# EAGLE design batt_mon_v1 (EAGLE 7.7.0)
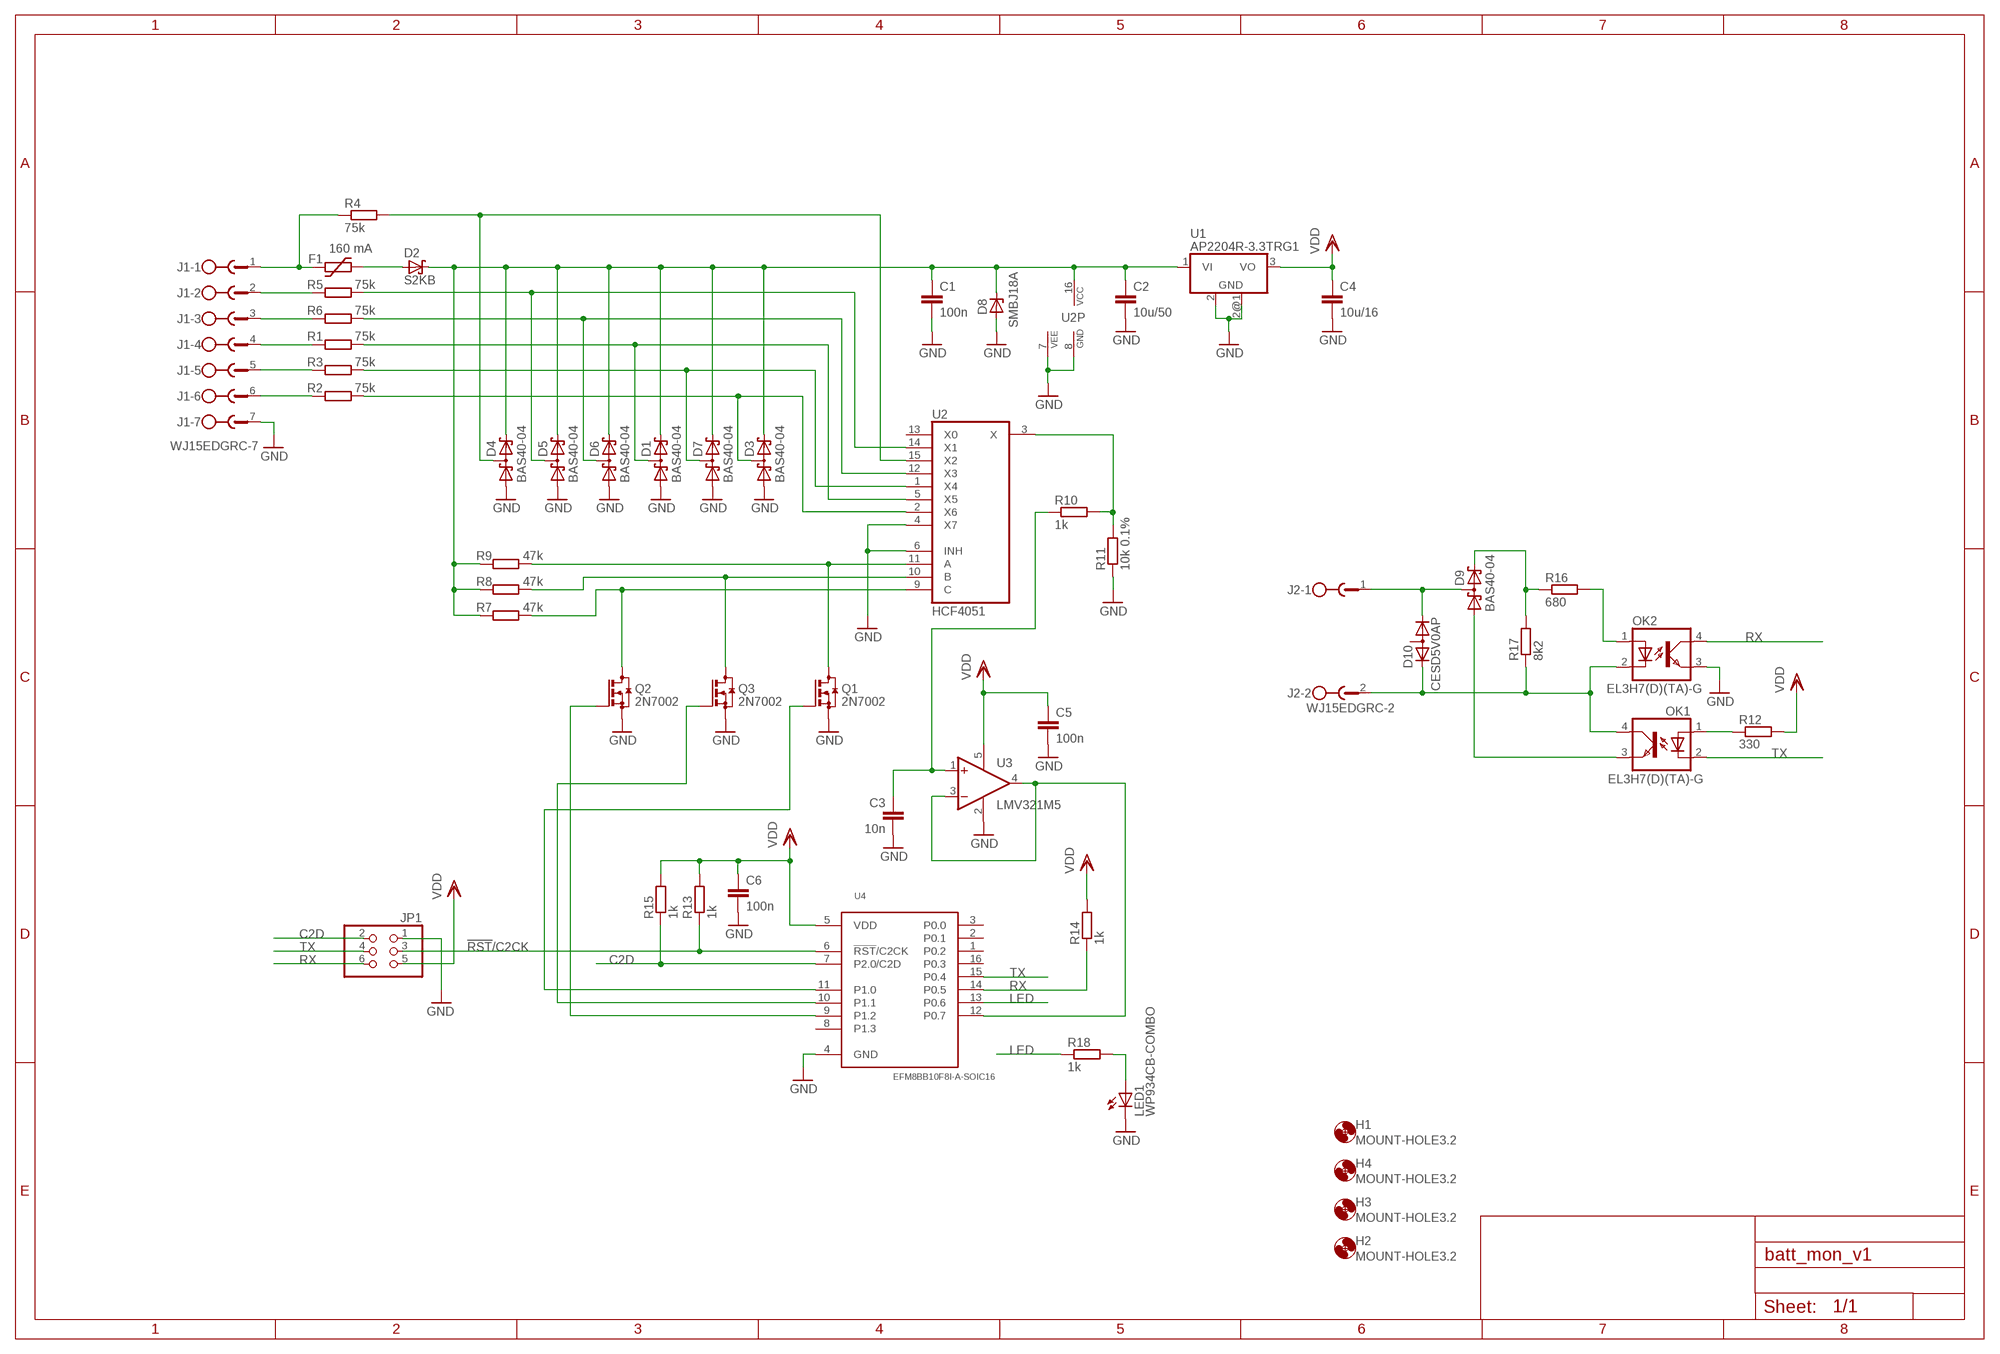
[diagram p0: schematic, sheet 1]

## Parts
C1  100n  C-EUC0805  [C0805]
C2  10u/50  C-EUC1206  [C1206]
C3  10n  C-EUC0805  [C0805]
C4  10u/16  C-EUC1206  [C1206]
C5  100n  C-EUC0805  [C0805]
C6  100n  C-EUC0805  [C0805]
D1  BAS40-04  [SOT23]
D2  S2KB  SCHOTTKY-DIODESMD  [SMB]
D3  BAS40-04  [SOT23]
D4  BAS40-04  [SOT23]
D5  BAS40-04  [SOT23]
D6  BAS40-04  [SOT23]
D7  BAS40-04  [SOT23]
D8  SMBJ18A  ZENER-DIODESMB  [SMB]
D9  BAS40-04  [SOT23]
D10  CESD5V0AP  DIODE-2CA|ACSOT23  [SOT23]
F1  160 mA  1206L  [1206L]
H1  MOUNT-HOLE3.2  [3,2]
H2  MOUNT-HOLE3.2  [3,2]
H3  MOUNT-HOLE3.2  [3,2]
H4  MOUNT-HOLE3.2  [3,2]
J1  WJ15EDGRC-7  [WJ15EDGRC-3.81-7]
J2  WJ15EDGRC-2  [WJ15EDGRC-3.81-2]
JP1  PINHD-2X3  [2X03]
LED1  WP934CB-COMBO  [WP934CB-COMBO]
OK1  EL3H7(D)(TA)-G  EL3H7  [MINI-FLAT-4]
OK2  EL3H7(D)(TA)-G  EL3H7  [MINI-FLAT-4]
Q1  2N7002  BSS123  [SOT23]
Q2  2N7002  BSS123  [SOT23]
Q3  2N7002  BSS123  [SOT23]
R1  75k  R-EU_R1206  [R1206]
R2  75k  R-EU_R1206  [R1206]
R3  75k  R-EU_R1206  [R1206]
R4  75k  R-EU_R1206  [R1206]
R5  75k  R-EU_R1206  [R1206]
R6  75k  R-EU_R1206  [R1206]
R7  47k  R-EU_R0805  [R0805]
R8  47k  R-EU_R0805  [R0805]
R9  47k  R-EU_R0805  [R0805]
R10  1k  R-EU_R0805  [R0805]
R11  10k 0.1%  R-EU_R0805  [R0805]
R12  330  R-EU_R0805  [R0805]
R13  1k  R-EU_R0805  [R0805]
R14  1k  R-EU_R0805  [R0805]
R15  1k  R-EU_R0805  [R0805]
R16  680  R-EU_R0805  [R0805]
R17  8k2  R-EU_R0805  [R0805]
R18  1k  R-EU_R0805  [R0805]
U1  AP2204R-3.3TRG1  MCP175433MB  [SOT89]
U2  HCF4051  4051D  [SO16]
U3  LMV321M5  [SOT23-5]
U4  EFM8BB10F8I-A-SOIC16  EFM8BB1  [SO16]

## Nets
!RST!/C2CK: JP1.3 R13.1 U4.6(!RST!/C2CK)
C2D: JP1.2 R15.1 U4.7(P2.0/C2D)
GND: C1.2 C2.2 C3.2 C4.2 C5.2 C6.2 D1.1(A1) D3.1(A1) D4.1(A1) D5.1(A1) D6.1(A1) D7.1(A1) D8.A J1.7 JP1.1 LED1.K1(C) LED1.K(C) OK2.3(EMIT) Q1.2(S) Q2.2(S) Q3.2(S) R11.1 U1.2(GND) U1.2@1(GND) U2.4(X7) U2.6(INH) U2.7(VEE) U2.8(GND) U3.2(V-) U4.4(GND)
LED: R18.1 U4.13(P0.6)
N$1: R10.2 R11.2 U2.3(X)
N$2: Q1.3(D) R9.2 U2.11(A)
N$3: Q3.3(D) R8.2 U2.10(B)
N$4: Q2.3(D) R7.2 U2.9(C)
N$5: D1.3(C1A2) R1.2 U2.5(X5)
N$6: F1.P$1 J1.1 R4.1
N$7: D4.3(C1A2) R4.2 U2.15(X2)
N$8: J1.2 R5.1
N$9: D5.3(C1A2) R5.2 U2.14(X1)
N$10: D6.3(C1A2) R6.2 U2.12(X3)
N$11: J1.3 R6.1
N$12: C3.1 R10.1 U3.1(+IN)
N$13: D2.A F1.P$2
N$14: J1.4 R1.1
N$15: Q2.1(G) U4.9(P1.2)
N$16: Q3.1(G) U4.10(P1.1)
N$17: Q1.1(G) U4.11(P1.0)
N$18: C1.1 C2.1 D1.2(C2) D2.C D3.2(C2) D4.2(C2) D5.2(C2) D6.2(C2) D7.2(C2) D8.C R7.1 R8.1 R9.1 U1.1(VI) U2.16(VCC)
N$19: J1.6 R2.1
N$20: J1.5 R3.1
N$21: OK2.1(A) R16.2
N$22: D9.1(A1) OK1.3(EMIT)
N$23: OK1.1(A) R12.1
N$24: D9.3(C1A2) D10.1(K1) J2.1
N$25: U3.3(-IN) U3.4(OUT) U4.12(P0.7)
N$26: D3.3(C1A2) R2.2 U2.2(X6)
N$27: D9.2(C2) R16.1 R17.2
N$28: LED1.A LED1.A1(A) R18.2
N$34: D7.3(C1A2) R3.2 U2.1(X4)
R-: D10.2(K2) J2.2 OK1.4(COL) OK2.2(C) R17.1
RX: JP1.6 OK2.4(COL) R14.1 U4.14(P0.5)
TX: JP1.4 OK1.2(C) U4.15(P0.4)
VDD: C4.1 C5.1 C6.1 JP1.5 R12.2 R13.2 R14.2 R15.2 U1.3(VO) U3.5(V+) U4.5(VDD)
Unconnected: D10.3(A) U2.13(X0) U4.1(P0.2) U4.2(P0.1) U4.3(P0.0) U4.8(P1.3) U4.16(P0.3)

## Library data of the parts
C1-C6 = rcl:C-EU: CAPACITOR, European symbol
D1 D3-D7 D9 = diode:BAS40-04: Silicon Schottky Diodes General-purpose diode for high-speed switching
D2 = diode:SCHOTTKY-DIODE: Schottky Diode
D8 = diode:ZENER-DIODE: Z-Diode
D10 = diode:DIODE-2CA|AC: Dual DIODE Cathode-Anode|Anode-Cathode
F1 = ptc-littlefuse (5):1206L
H1-H4 = holes:MOUNT-HOLE: MOUNTING HOLE with drill center marker
J1 = WJ15EDGRC:WJ15EDGRC-7
J2 = WJ15EDGRC:WJ15EDGRC-2
JP1 = pinhead:PINHD-2X3: PIN HEADER
LED1 = WP934CB:WP934CB: Low Current (2mA) LED 3 mm Tinted Diffused Package color RED Source: Data sheet <http://www.farnell.com/datasheets/391100.pdf>
OK1 OK2 = opto:EL3H7
Q1-Q3 = transistor-small-signal:BSS123: N-CHANNEL MOS FET
R1-R18 = rcl:R-EU_: RESISTOR, European symbol
U1 = MCP1754:MCP1754*: 250 mA, 16V, Low Quiescent Current LDO Regulator Source: http://ww1.microchip.com/downloads/en/DeviceDoc/22049b.pdf; MOUSER: 579-MCP1755ST1802EDB
U2 = 40xx:4051: 8-channel ANALOG MULTIPLEXER
U3 = linear:LMV321?*: General Purpose, Low Voltage, Rail-to-Rail Output Operational Amplifiers Source: http://www.national.com/mpf/LM/LMV321.html http://www.national.com/dt/lmv_qual.pdf
U4 = efm8:EFM8BB1

## Board
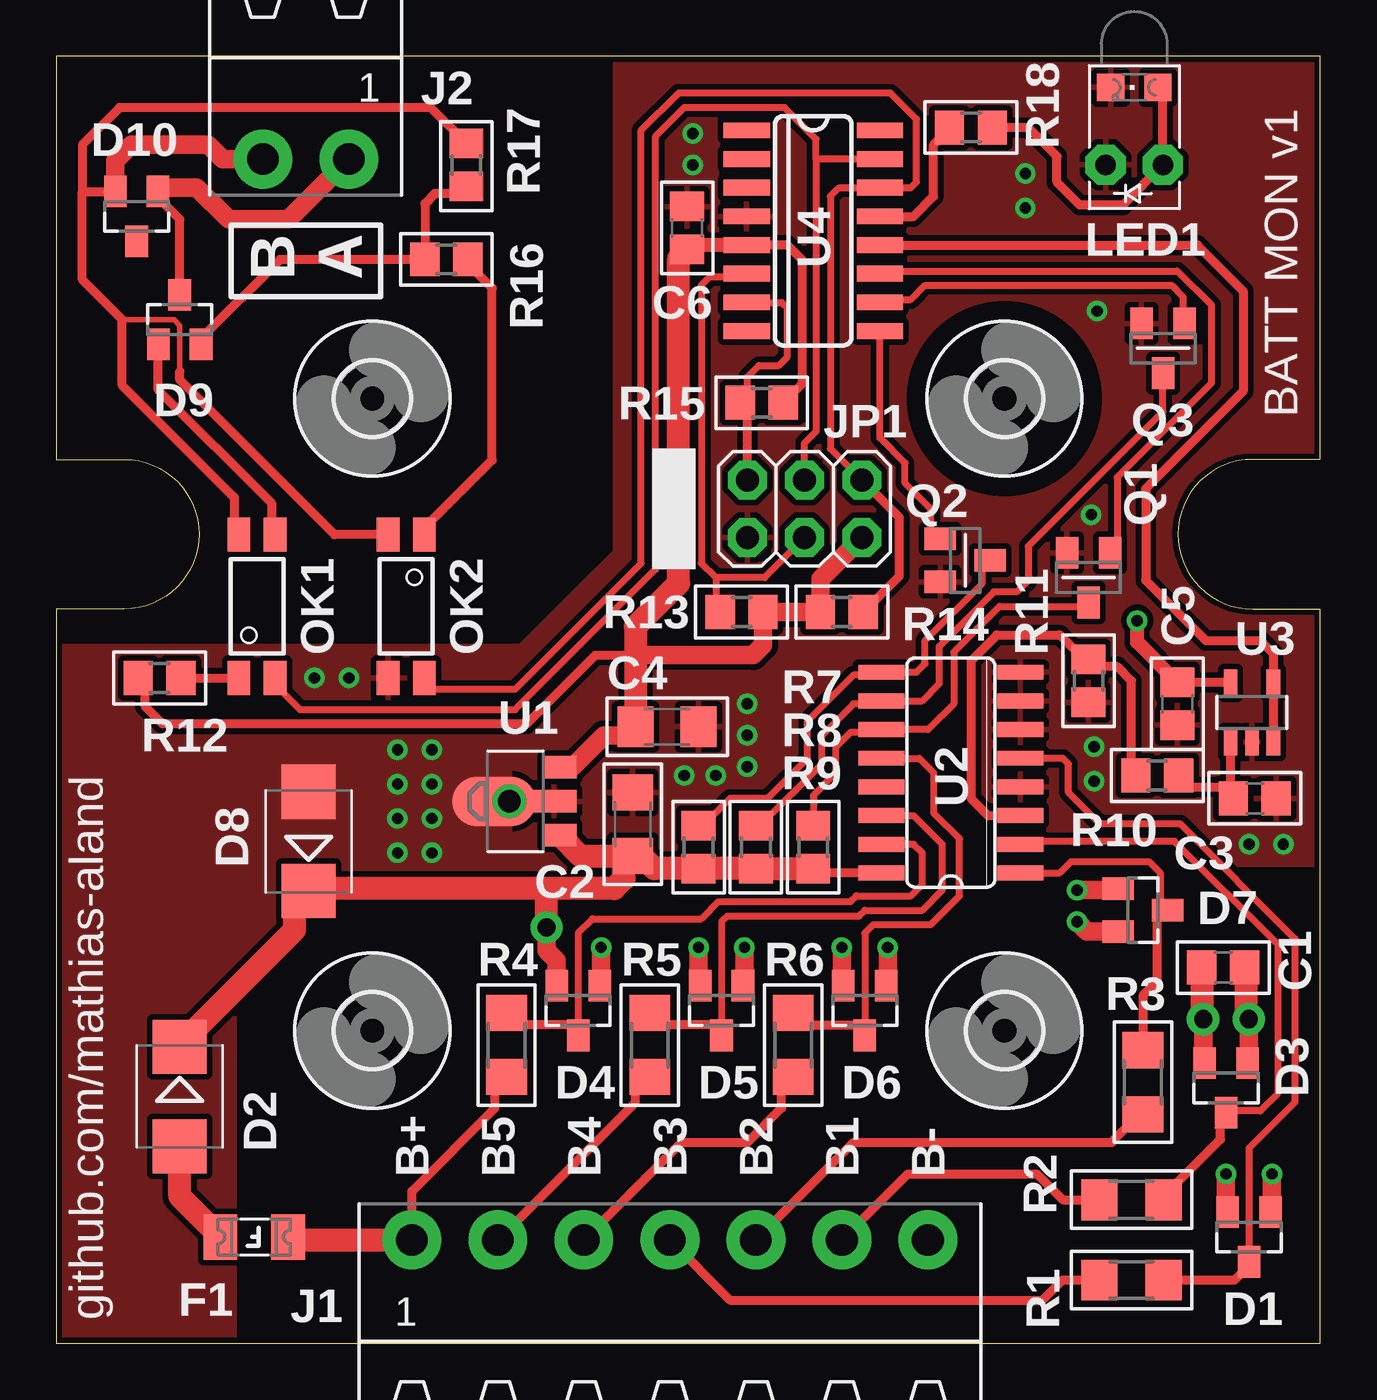
[diagram p1: board, top side]
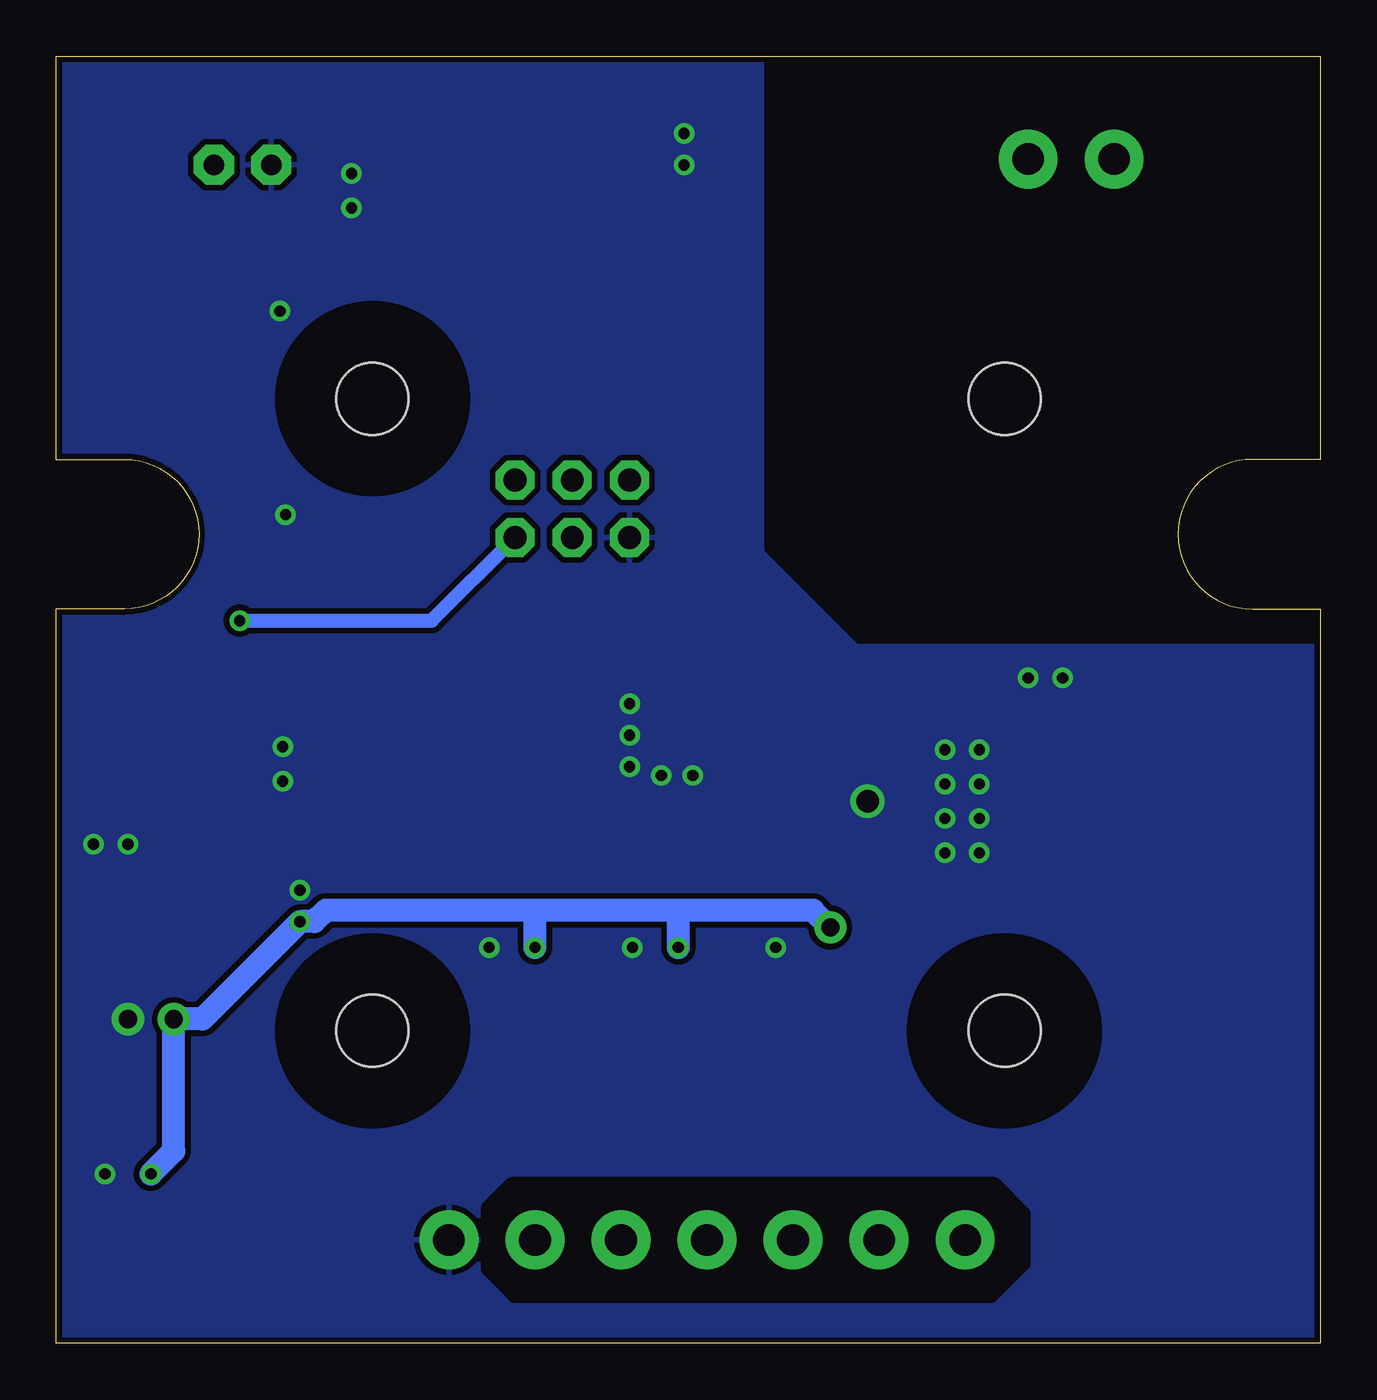
[diagram p2: board, bottom side, seen from below]

Size 56 x 57 mm. Coordinates in mm from the lower left corner, seen from the top.
Outline: 0,0 56,0 56,32.52 53,32.52 arc-180 53,39.15 56,39.15 56,57 0,57 0,39.15 3,39.15 arc-180 3,32.52 0,32.52 0,0
Copper layers (1*16): Top 0.035mm / dielectric 1.6mm / Bottom 0.035mm
Design rules "m_ *": minimum track width 8mil, minimum drill 12mil, track to track 9mil, track to pad 9mil, pad to pad 9mil, via to via 9mil, smd to smd 0mil, copper to edge 10mil, drill to drill 10mil, minimum pad ring 12mil, minimum via ring 8mil, stop-mask expansion 2mil, vias tented up to drill 0mil, thermal gap 10mil
bRestrict: area 13.2,2.2 to 36.8,7

### Footprints (pad centres in the part's own frame; a part is rotated, then mirrored left to right if it is on the bottom)
C0805 = smd 1.3 x 1.5: 1 -0.95,0; 2 0.95,0
C1206 = smd 1.6 x 1.8: 1 -1.4,0; 2 1.4,0
SOT23 = smd 1 x 1.4: 1 -0.95,-1.1; 2 0.95,-1.1; 3 0,1.1
SMB = smd 2.4 x 2.4: A 2.2,0; C -2.2,0
1206L = smd 1.5 x 2: P$1 -1.5,0; P$2 1.5,0
3,2 = hole 3.2: 0,0
WJ15EDGRC-3.81-7 = drill 1.4 pad 2.6: 1 -11.43,0; 2 -7.62,0; 3 -3.81,0; 4 0,0; 5 3.81,0; 6 7.62,0; 7 11.43,0
WJ15EDGRC-3.81-2 = drill 1.4 pad 2.6: 1 -1.905,0; 2 1.905,0
2X03 = drill 1.016 octagon: 1 -2.54,-1.27; 2 -2.54,1.27; 3 0,-1.27; 4 0,1.27; 5 2.54,-1.27; 6 2.54,1.27
WP934CB-COMBO = drill 0.9 pad 1.778 octagon: A 1.27,0; K -1.27,0 | smd 1.2 x 1.2: A1 1.05,3.429; K1 -1.05,3.429
MINI-FLAT-4 = smd 1.5 x 1: 1 -3.175,0.8; 2 -3.175,-0.8; 3 3.175,-0.8; 4 3.175,0.8
R1206 = smd 1.6 x 1.803: 1 -1.422,0; 2 1.422,0
R0805 = smd 1.3 x 1.5: 1 -0.95,0; 2 0.95,0
SOT89 = smd 1 x 1.5: 1 -1.499,-1.981; 3 1.499,-1.981 | smd 1 x 2: 2 0,-1.727 | smd 2.2 x 3.7: 2@1 0,0.94
SO16 = smd 0.66 x 2.032: 1 -4.445,-3.073; 2 -3.175,-3.073; 3 -1.905,-3.073; 4 -0.635,-3.073; 5 0.635,-3.073; 6 1.905,-3.073; 7 3.175,-3.073; 8 4.445,-3.073; 9 4.445,3.073; 10 3.175,3.073; 11 1.905,3.073; 12 0.635,3.073; 13 -0.635,3.073; 14 -1.905,3.073; 15 -3.175,3.073; 16 -4.445,3.073
SOT23-5 = smd 0.6 x 1.2: 1 -0.95,-1.306; 2 0,-1.306; 3 0.95,-1.306; 4 0.95,1.306; 5 -0.95,1.306
SO16' = smd 0.7 x 2.05: 1 -4.445,-2.95; 2 -3.175,-2.95; 3 -1.905,-2.95; 4 -0.635,-2.95; 5 0.635,-2.95; 6 1.905,-2.95; 7 3.175,-2.95; 8 4.445,-2.95; 9 4.445,2.95; 10 3.175,2.95; 11 1.905,2.95; 12 0.635,2.95; 13 -0.635,2.95; 14 -1.905,2.95; 15 -3.175,2.95; 16 -4.445,2.95

### Placement (x,y rotation side)
C1  51.69,16.64 0 top
C2  25.53,22.99 90 top
C3  53.09,24.13 0 top
C4  27.05,27.3 0 top
C5  49.66,28.32 270 top
C6  27.94,49.4 90 top
D1  52.83,4.7 180 top
D2  5.46,10.92 270 top
D3  51.82,11.3 180 top
D4  23.11,14.73 180 top
D5  29.46,14.73 180 top
D6  35.81,14.73 180 top
D7  48.13,19.18 270 top
D8  11.18,22.23 90 top
D9  5.46,45.34 0 top
D10  3.56,49.91 180 top
F1  8.76,4.7 180 top
H1  14,13.84 0 top
H2  42,13.84 0 top
H3  14,41.84 0 top
H4  42,41.84 0 top
J1  27.18,4.57 0 top
J2  11.05,52.45 180 top
JP1  33.15,36.96 0 top
LED1  47.75,52.2 0 top
OK1  8.89,32.64 90 top
OK2  15.49,32.64 270 top
Q1  45.72,33.91 180 top
Q2  40.26,34.67 270 top
Q3  49.02,44.07 180 top
R1  47.62,2.79 0 top
R2  47.62,6.35 0 top
R3  48.13,11.56 90 top
R4  19.94,13.21 90 top
R5  26.29,13.21 90 top
R6  32.64,13.21 90 top
R7  28.45,21.97 90 top
R8  30.99,21.97 90 top
R9  33.53,21.97 90 top
R10  48.77,25.15 180 top
R11  45.72,29.34 90 top
R12  4.57,29.46 180 top
R13  30.35,32.38 0 top
R14  34.8,32.38 180 top
R15  31.24,41.66 0 top
R16  17.27,48.01 0 top
R17  18.16,52.2 270 top
R18  40.51,53.85 0 top
U1  20.32,24 90 top
U2  39.62,25.27 90 top
U3  52.96,27.94 0 top
U4  EFM8BB10F8I-A-SOIC16  [SO16']  33.53,49.28 270 top

### Tracks (layer width: path | path; a pad name or v marks a point on that pad's centre or on a via)
!RST!/C2CK
  Top 0.305: U4.6 30.45,47.24 28.96,47.24 28.57,46.86 28.57,34.54 29.21,33.91 | JP1.3 31.37,33.91 29.21,33.91 | 29.21,33.91 29.21,32.58 R13.1
C2D
  Top 0.305: U4.7 32.13,46.1 32.38,45.85 32.38,43.69 32,43.31 31.11,43.31 30.61,42.8 30.61,41.97 R15.1
  Top 0.406: JP1.2 30.61,41.34 R15.1
GND  (via drill 0.5, 0.8 pad 1.42, 1)
  Top 0.813: D6.1 36.83,15.9 v36.83,17.53 | D5.1 30.48,15.9 v30.48,17.53 | D4.1 24.13,15.9 v24.13,17.53 | v45.21,20.07 46.97,20.07 D7.1 | D3.1 52.83,12.47 v52.83,14.35 | D1.1 53.85,5.87 v53.85,7.49
  Top 1.016: v52.83,14.35 52.7,14.48 52.7,16.57 C1.2
  other vias: 45.97,26.42 45.97,24.89 30.61,28.32 30.61,26.92 28.19,53.59 45.85,36.7 16.64,26.29 16.64,24.77 16.64,23.24 16.64,21.72 15.11,26.29 15.11,24.77 15.11,23.24 15.11,21.72 12.95,29.46 28.19,52.2 46.1,45.72 42.93,51.82 42.93,50.29 27.81,25.15 29.21,25.15 30.61,25.53 11.43,29.46 52.83,22.1 54.36,22.1 20.07,24
  pour Top (isolate 0.254, rank 6): -0.64,9.27 -0.51,3.05 -0.51,0 7.87,0 7.87,14.73 11.94,18.8 40.64,18.8 43.05,21.21 55.97,21.21 55.97,56.86 24.77,56.86 24.77,35.05 20.57,30.86 -1.4,30.86
  pour Bottom (isolate 0.254, rank 6): -0.89,0 55.97,0 55.97,56.86 24.77,56.86 24.77,35.05 20.57,30.86 -1.4,30.86 0,9.27 -0.89,6.99
  pour Top (isolate 0.254, no thermals): 16.38,25.91 20.07,25.91 20.07,22.1 16.38,22.1
  pour Top (isolate 0.254, no thermals): 9.27,26.42 12.95,26.42 12.95,22.61 9.27,22.61
LED
  Top 0.406: U4.13 37.97,49.91 38.86,50.8 38.86,53.09 39.56,53.79 R18.1
N$1
  Top 0.406: U2.3 41.27,23.37 40.51,24.13 40.51,30.23 41.66,31.37 44.45,31.37 45.53,30.29 R11.2 46.03,29.97 46.99,29.97 47.62,29.34 47.62,25.15 R10.2
N$2
  Top 0.305: 33.59,22.92 R9.2 33.53,24.26 34.54,25.27 34.54,26.42 35.18,27.05 36.42,27.05 U2.11 38.61,27.18 39.75,28.32 39.75,30.61 41.78,32.64 45.55,32.64 Q1.3
N$3
  Top 0.305: R8.2 31.18,22.92 33.91,25.65 33.91,26.92 35.31,28.32 36.42,28.32 U2.10 38.35,28.45 39.12,29.21 39.12,30.86 41.53,33.27 42.55,33.27 43.05,33.78 43.05,35.31 49.02,41.27 Q3.3
N$4
  Top 0.305: R7.2 28.64,22.92 29.84,24.13 31.5,24.13 33.27,25.91 33.27,27.56 35.31,29.59 35.94,29.59 36.07,29.72 U2.9 38.1,29.72 38.48,30.1 38.48,31.11 41.02,33.66 41.02,34.42 41.27,34.67 Q2.3
N$5
  Top 0.305: D1.3 52.83,8.64 54.86,10.67 54.86,17.91 49.78,22.99 46.23,22.99 44.83,24.38 44.83,25.65 44.58,25.91 U2.5
  Top 0.406: R1.2 52.2,2.79 52.83,3.43 D1.3
N$6
  Top 0.406: J1.1 15.75,6.73 19.43,10.41 19.43,11.79 R4.1
  Top 1.016: F1.P$1 10.39,4.57 J1.1
N$7
  Top 0.305: D4.3 23.11,18.16 23.75,18.8 28.57,18.8 29.34,19.56 35.18,19.56 35.43,19.81 37.85,19.81 38.35,20.32 38.35,21.72 37.97,22.1 U2.15
  Top 0.406: D4.3 23.11,14.1 20.47,14.1 R4.2
  Top 0.61: R4.2 19.98,14.67
N$8
  Top 0.406: J1.2 25.65,10.67 25.65,11.3 26.14,11.79 R5.1
N$9
  Top 0.305: U2.14 37.97,23.37 39.24,22.1 39.24,20.07 38.35,19.18 35.81,19.18 35.56,18.92 29.72,18.92 29.46,18.67 D5.3
  Top 0.406: D5.3 29.46,14.1 26.82,14.1 R5.2
N$10
  Top 0.305: U2.12 38.23,25.91 38.86,25.27 38.86,23.5 40.01,22.35 40.01,19.81 38.73,18.54 36.2,18.54 35.81,18.16 D6.3
  Top 0.406: R6.2 33.17,14.1 35.81,14.1 D6.3
N$11
  Top 0.406: J1.3 27.69,8.89 30.61,8.89 32.13,10.41 32.13,11.28 R6.1
N$12
  Top 0.406: U3.1 52.01,24.26 C3.1 52.14,24.64 49.72,24.64 R10.1
N$13
  Top 1.016: F1.P$2 5.46,6.5 D2.A
N$14
  Top 0.406: R1.1 44.58,2.79 43.69,1.91 29.84,1.91 J1.4
N$15
  Top 0.305: Q2.1 38.73,35.62 38.73,36.96 37.59,38.1 37.59,38.99 36.48,40.1 U4.9
N$16
  Top 0.305: U4.10 36.6,46.23 37.85,46.23 38.48,46.86 49.4,46.86 49.91,46.35 49.91,45.23 Q3.1
N$17
  Top 0.305: U4.11 36.6,47.5 49.66,47.5 51.18,45.97 51.18,42.55 46.99,38.35 46.99,35.33 Q1.1
N$18  (via drill 0.5, 0.8 pad 1.42)
  Top 0.406: U2.16 33.72,20.83 R9.1
  Top 0.813: D6.2 34.8,15.9 v34.8,17.53 | D5.2 28.45,15.9 v28.45,17.53 | D4.2 22.16,16.95 21.72,17.4 v21.72,18.41 | D7.2 45.65,18.23 v45.21,18.67 | D3.2 50.8,12.47 v50.8,14.35 | D1.2 51.82,5.87 v51.82,7.49
  Top 1.016: R9.1 R8.1 R7.1 26.48,21.02 25.91,21.59 C2.1 | 21.72,20.13 24.7,20.13 25.15,20.57 25.15,21.21 C2.1 | U1.1 23.22,21.59 C2.1 | v21.72,18.41 21.72,20.13 | C1.1 50.74,14.41 v50.8,14.35 | 21.72,20.13 11.28,20.13 D8.C 10.54,20.02 10.54,18.29 5.46,13.21 D2.C
  Bottom 1.016: v21.72,18.41 22.48,19.18 28.45,19.18 | v28.45,17.53 28.45,19.18 | 28.45,19.18 34.8,19.18 | 34.8,19.18 44.07,19.18 44.58,18.67 v45.21,18.67 49.53,14.35 v50.8,14.35 50.8,8.51 v51.82,7.49 | v34.8,17.53 34.8,19.18
N$19
  Top 0.406: J1.6 37.72,7.49 43.43,7.49 44.58,6.35 R2.1
N$20
  Top 0.406: J1.5 35.31,8.89 46.74,8.89 47.98,10.13 R3.1
N$21
  Top 0.406: OK2.1 16.29,36.11 19.3,39.12 19.3,46.74 18.22,47.82 R16.2
N$22
  Top 0.406: D9.1 4.51,42.23 9.53,37.21 9.53,35.81 OK1.3
N$23
  Top 0.406: R12.1 OK1.1
N$24
  Top 0.406: D9.3 5.46,49.78 4.51,50.74 D10.1
  Top 0.813: J2.1 10.29,49.78 7.62,49.78 6.22,51.18 4.51,51.18 D10.1
N$25
  Top 0.406: U4.12 50.55,48.64 52.58,46.61 52.58,42.16 48.26,37.85 48.26,33.78 50.93,31.11 53.34,31.11 53.91,30.55 U3.4 U3.3
N$26
  Top 0.305: U2.2 42.82,22.23 49.53,22.23 54.1,17.65 54.1,11.05 53.34,10.29 51.9,10.29 D3.3
  Top 0.406: R2.2 49.05,6.5 51.56,9.02 51.56,9.95 D3.3
N$27
  Top 0.406: R17.2 17.84,50.93 16.76,50.93 16.32,50.48 R16.1 9.91,48.01 6.41,44.51 D9.2
N$28
  Top 0.406: R18.2 43.05,53.85 44.32,52.58 44.32,51.44 45.34,50.42 47.24,50.42 LED1.A 49.02,55.63 LED1.A1
N$34
  Top 0.305: U2.1 44.45,20.83 44.96,21.34 48.39,21.34 48.9,20.83 48.9,19.52 D7.3
  Top 0.406: D7.3 48.77,19.18 48.77,16.03 48.13,15.39 R3.2
R-
  Top 0.254: 2.92,45.34 5.21,45.34 5.46,45.09 5.46,43.05
  Top 0.406: OK2.2 12.32,35.81 5.46,42.67 5.46,43.05 | R17.1 16.57,54.74 2.79,54.74 1.14,53.09 1.14,51.01 | 1.14,51.01 D10.2 | 1.14,51.01 1.14,47.12 2.92,45.34 2.92,42.42 7.87,37.47 7.87,35.81 OK1.4
  Top 0.813: D10.2 2.61,52.39 3.3,53.09 6.73,53.09 7.37,52.45 J2.2
RX
  Top 0.305: JP1.6 34.29,39.62 34.29,50.8 34.67,51.18 U4.14 37.85,51.18 38.1,51.44 38.1,54.23 36.96,55.37 27.56,55.37 25.91,53.72 25.91,34.54 20.32,28.96 16.29,28.96 OK2.4
  Top 0.406: R14.1 37.34,33.98 37.34,36.58 JP1.6
TX
  Top 0.305: 33.66,52.45 33.66,53.34 32.26,54.74 27.81,54.74 26.54,53.47 26.54,34.29 20.32,28.07 10.79,28.07 9.69,29.17 OK1.2 | U4.15 33.66,52.45 | 33.66,52.45 33.66,40.39 33.15,39.88 JP1.4
VDD  (via drill 0.5)
  Top 0.406: U4.5 32.38,48.64 33.02,48.01 33.02,42.48 R15.2 | 25.65,30.48 23.88,30.48 20.83,27.43 4.7,27.43 3.94,28.19 3.94,29.15 R12.2 | U3.5 51.98,29.27 C5.1
  Top 0.61: U4.5 28.13,48.64 C6.1 | C5.1 47.88,31.05 v47.88,32
  Top 0.813: JP1.5 33.85,33.85 R14.2 R13.2 31.3,30.92 30.86,30.48 25.65,30.48 | U1.3 22.84,25.5 24.26,26.92 25.65,26.92 C4.1
  Top 1.016: C6.1 27.56,48.07 27.56,33.66 25.65,31.75 25.65,30.48 C4.1
  Bottom 0.61: v47.88,32 39.37,32 JP1.5

### Text on the board
tPlace: B / A | BATT MON v1 | B+ | B5 | B4 | B3 | B2 | B1 | B- | github.com/mathias-aland